# Altium schematic sheet LV_Sensing.SchDoc
size A4; SheetNumber: 4; SheetTotal: 6
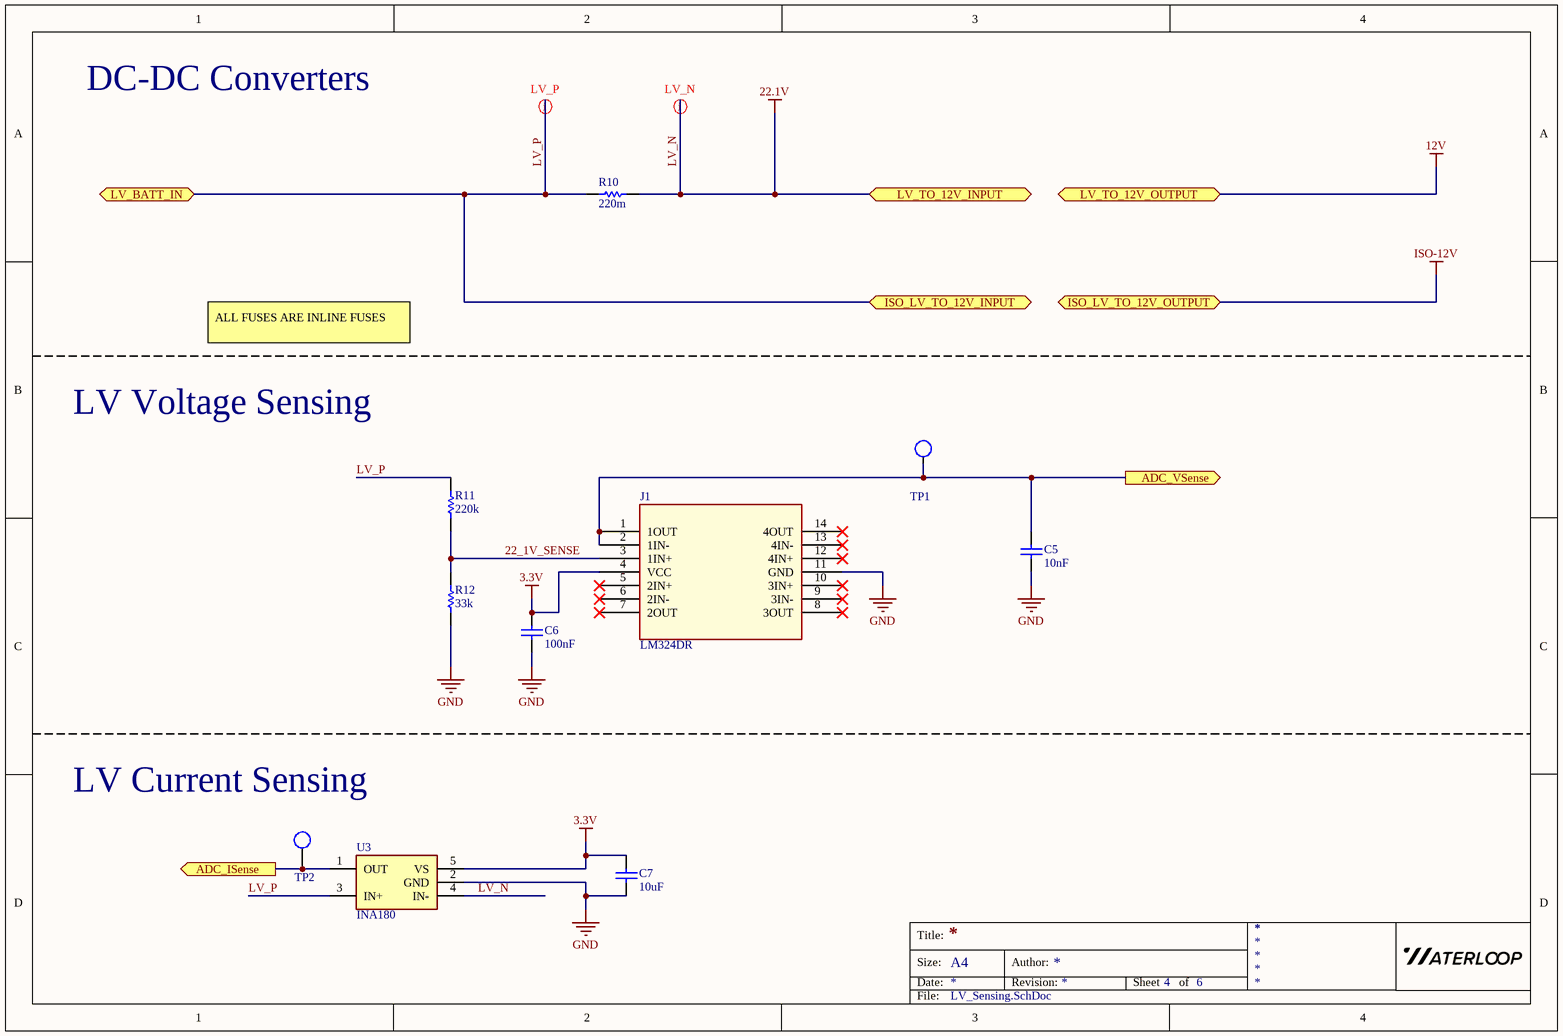
[diagram p0: LV_Sensing.SchDoc]

## Parts
C5  value 10nF  [0603 - Capacitor]  (hidden comment: Capacitor - Nonpolarized)
C6  value 100nF  [0603 - Capacitor]  (hidden comment: Capacitor - Nonpolarized)
C7  value 10uF  [0603 - Capacitor]  (hidden comment: Capacitor - Nonpolarized)
J1  LM324DR  [LM324DR]
R10  value 220m  [2512 - RESISTOR]  (hidden comment: Resistor)
R11  value 220k  [0603 - Resistor]  (hidden comment: Resistor)
R12  value 33k  [0603 - Resistor]  (hidden comment: Resistor)
TP1  Test Point  [Test Point]  (value not drawn)  (no BOM)
TP2  Test Point  [Test Point]  (value not drawn)  (no BOM)
U3  INA180  [INA180]

## Ports
ADC_ISense (out), ADC_VSense (out), ISO_LV_TO_12V_INPUT (bidir), ISO_LV_TO_12V_OUTPUT (bidir), LV_BATT_IN (bidir), LV_TO_12V_INPUT (bidir), LV_TO_12V_OUTPUT (bidir)

## Nets
3.3V: C6.2 C7.2 J1.4(VCC) U3.5(VS)
12V: port LV_TO_12V_OUTPUT
GND: C5.1 C6.1 C7.1 J1.11(GND) R12.1 U3.2(GND)
ISO-12V: port ISO_LV_TO_12V_OUTPUT
LV_N: R10.2 U3.4(IN-) ; port LV_TO_12V_INPUT  [also labelled 22.1V]
22_1V_SENSE: J1.3(1IN+) R11.2 R12.2
ADC_ISense: TP2.1 U3.1(OUT) ; port ADC_ISense
ADC_VSense: C5.2 J1.1(1OUT) J1.2(1IN-) TP1.1 ; port ADC_VSense
LV_P: R10.1 R11.1 U3.3(IN+) ; port LV_BATT_IN, port ISO_LV_TO_12V_INPUT

Not connected (* = marked no-connect by the designer): J1 5(2IN+)* 6(2IN-)* 7(2OUT)* 8(3OUT)* 9(3IN-)* 10(3IN+)* 12(4IN+)* 13(4IN-)* 14(4OUT)*

## Layout directives
differential pair: LV_N, LV_P

## Notes on the sheet
- DC-DC Converters
- ALL FUSES ARE INLINE FUSES
- LV Voltage Sensing
- LV Current Sensing
- Title:
- Size:
- Date:
- A4
- Author:
- Revision:
- Sheet
- of
- File:

## Library data of the parts
C5-C7 = Capacitor - Nonpolarized: Nonpolarized Capacitor; Supplier Part Number: *; Supplier: *; Manufacturer: *; Rating: *; Manufacturer Part Number: *
J1 = LM324DR: General Purpose Amplifier 4 Circuit 14-SOIC; Manufacturer Name: TI; Manufacturer Part Number: LM324DR; Supplier: Digikey; Supplier Part Number: 296-14597-2-ND
U3 = INA180: 0V to 26V Current Sense Amplifier; Manufacturer: Texas Instruments; Manufacturer Part Number: INA180A2IDBVR; Supplier Part Number: 296-47653-1-ND; Supplier: Digikey; ComponentLink1Description: Datasheet; ComponentLink1URL: https://www.ti.com/lit/ds/symlink/ina180.pdf?ts=1618562671692&ref_url=https%253A%252F%252Fwww.google.com%252F
R10-R12 = Resistor: Rating: *; Manufacturer Part Number: *; Manufacturer: *; Supplier Part Number: *; Supplier: *